# EAGLE design Elektor 1GHz RF Probe (EAGLE 5.12)
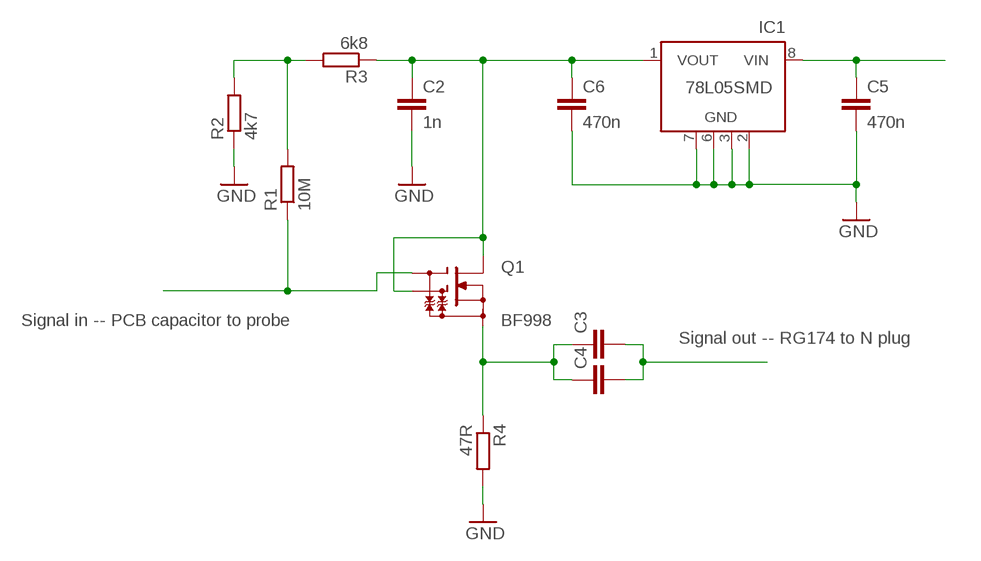
[diagram p0: schematic, sheet 1]

## Parts
C2  1n  C-EUC0805  [C0805]
C3  C-EUC0805  [C0805]
C4  C-EUC0805  [C0805]
C5  470n  C-EUC0805  [C0805]
C6  470n  C-EUC0805  [C0805]
IC1  78L05SMD  [SO08]
Q1  BF998  [SOT143]
R1  10M  R-EU_R0805  [R0805]
R2  4k7  R-EU_R0805  [R0805]
R3  6k8  R-EU_R0805  [R0805]
R4  47R  R-EU_R0805  [R0805]

## Nets
+5B: C2.1 C6.1 IC1.1(VOUT) Q1.2(DRAIN) Q1.3(G2) R3.1
GND: C2.2 C5.2 C6.2 IC1.2(GND) IC1.3(GND) IC1.6(GND) IC1.7(GND) R2.1 R4.2
N$2: C3.1 C4.1 Q1.1(SOURCE) R4.1
N$3: R1.2 R2.2 R3.2
N$5: C5.1 IC1.8(VIN)
SIGNAL_IN: Q1.4(G1) R1.1
SIGNAL_OUT: C3.2 C4.2
Unconnected: IC1.4(NC) IC1.5(NC)

## Notes on the sheet
- Signal in -- PCB capacitor to probe
- Signal out -- RG174 to N plug

## Library data of the parts
C2-C6 = rcl:C-EU: CAPACITOR, European symbol
IC1 = linear:78L*SMD: Positive VOLTAGE REGULATOR
Q1 = RF_Probe:BF998: Silicon N-Channel Dual Gate MOSFET
R1-R4 = rcl:R-EU_: RESISTOR, European symbol

## Board
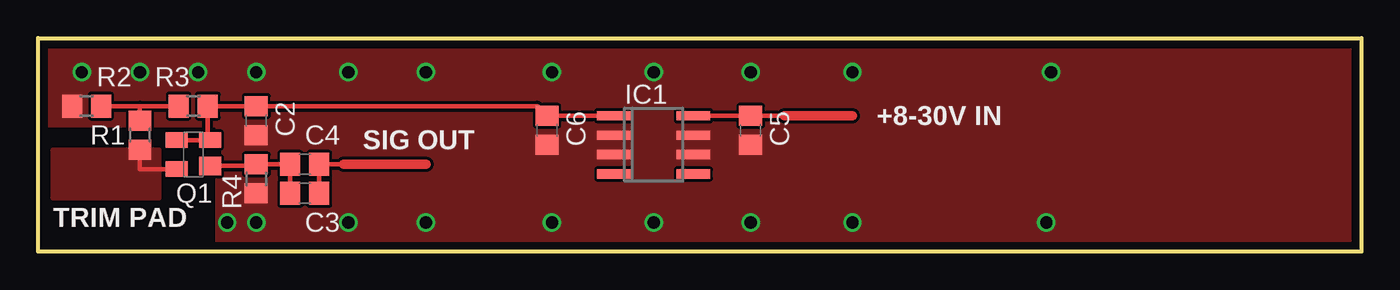
[diagram p1: board, top side]
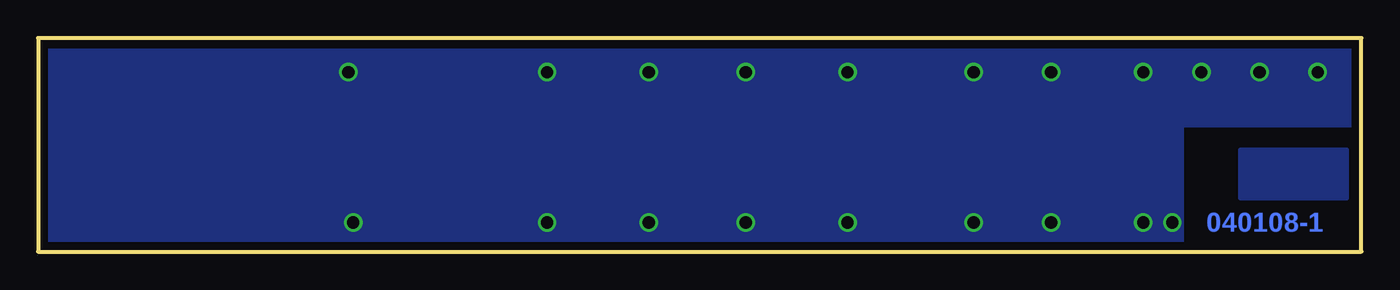
[diagram p2: board, bottom side, seen from below]

Size 86.68 x 13.97 mm. Coordinates in mm from the lower left corner, seen from the top.
Outline: 0,0 0,13.97 86.68,13.97 86.68,0 0,0
Copper layers (1*16): Top 0.035mm / dielectric 1.5mm / Bottom 0.035mm
Design rules "default *": minimum track width 10mil, minimum drill 24mil, track to track 8mil, track to pad 8mil, pad to pad 8mil, via to via 8mil, smd to smd 8mil, copper to edge 20mil, drill to drill 8mil, minimum pad ring 10mil, minimum via ring 8mil, stop-mask expansion 4mil, vias tented up to drill 0mil, thermal gap 10mil

### Footprints (pad centres in the part's own frame; a part is rotated, then mirrored left to right if it is on the bottom)
C0805 = smd 1.3 x 1.5: 1 -0.95,0; 2 0.95,0
SO08 = smd 0.6 x 2.2: 1 -1.905,-2.6; 2 -0.635,-2.6; 3 0.635,-2.6; 4 1.905,-2.6; 5 1.905,2.6; 6 0.635,2.6; 7 -0.635,2.6; 8 -1.905,2.6
SOT143 = smd 1.2 x 1.44: 1 -0.75,-1.1 | smd 1 x 1.44: 2 0.95,-1.1; 3 0.95,1.1; 4 -0.95,1.1
R0805 = smd 1.3 x 1.5: 1 -0.95,0; 2 0.95,0

### Placement (x,y rotation side)
C2  14.29,8.57 270 top
C3  17.46,5.71 0 top
C4  17.46,3.81 0 top
C5  46.67,7.94 270 top
C6  33.34,7.94 270 top
IC1  40.32,6.99 270 top
Q1  10.16,6.35 90 top
R1  6.67,7.62 90 top
R2  3.17,9.53 0 top
R3  10.16,9.53 180 top
R4  14.29,4.76 270 top

### Tracks (layer width: path | path; a pad name or v marks a point on that pad's centre or on a via)
+5B
  Top 0.305: Q1.3 Q1.2 11.11,7.3 R3.1 C2.1 32.7,9.52 C6.1 IC1.1
GND  (via drill 0.8)
  other vias: 66.36,11.75 66.04,1.9 53.34,1.9 53.34,11.75 46.67,11.75 46.67,1.9 40.32,1.9 40.32,11.75 33.66,11.75 33.66,1.9 25.4,1.9 25.4,11.75 20.32,11.75 20.32,1.9 14.29,1.9 12.38,1.9 14.29,11.75 10.48,11.75 6.67,11.75 2.86,11.75
  pour Top (no thermals): 0.32,8.26 0.32,13.34 86.36,13.34 86.36,0.32 11.75,0.32 11.75,8.26
  pour Bottom (no thermals): 86.36,0.32 86.36,13.34 0.32,13.34 0.32,8.26 11.75,8.26 11.75,0.32
N$2
  Top 0.305: Q1.1 14.29,5.6 R4.1 | R4.1 | R4.1 C3.1 C4.1
N$3
  Top 0.305: R2.2 6.67,9.52 | 6.67,9.52 R3.2 | 6.67,9.52 R1.2
N$5
  Top 0.305: IC1.8 C5.1 48.89,8.89 48.9,8.89
  Top 0.61: 48.9,8.89 53.34,8.89
S$2
  pour Bottom: 7.94,3.49 7.94,6.67 0.95,6.67 0.95,3.49
SIGNAL_IN
  Top 0.305: R1.1 6.67,5.4 Q1.4
  pour Top (no thermals): 0.95,6.67 0.95,3.49 7.94,3.49 7.94,6.67
SIGNAL_OUT
  Top 0.305: C4.2 C3.2 20,5.71
  Top 0.61: 20,5.71 25.4,5.71

### Text on the board
Bottom: 040108-1
tPlace: +8-30V IN | SIG OUT | TRIM PAD